# Altium project Votage_Source_v2.PrjPcb
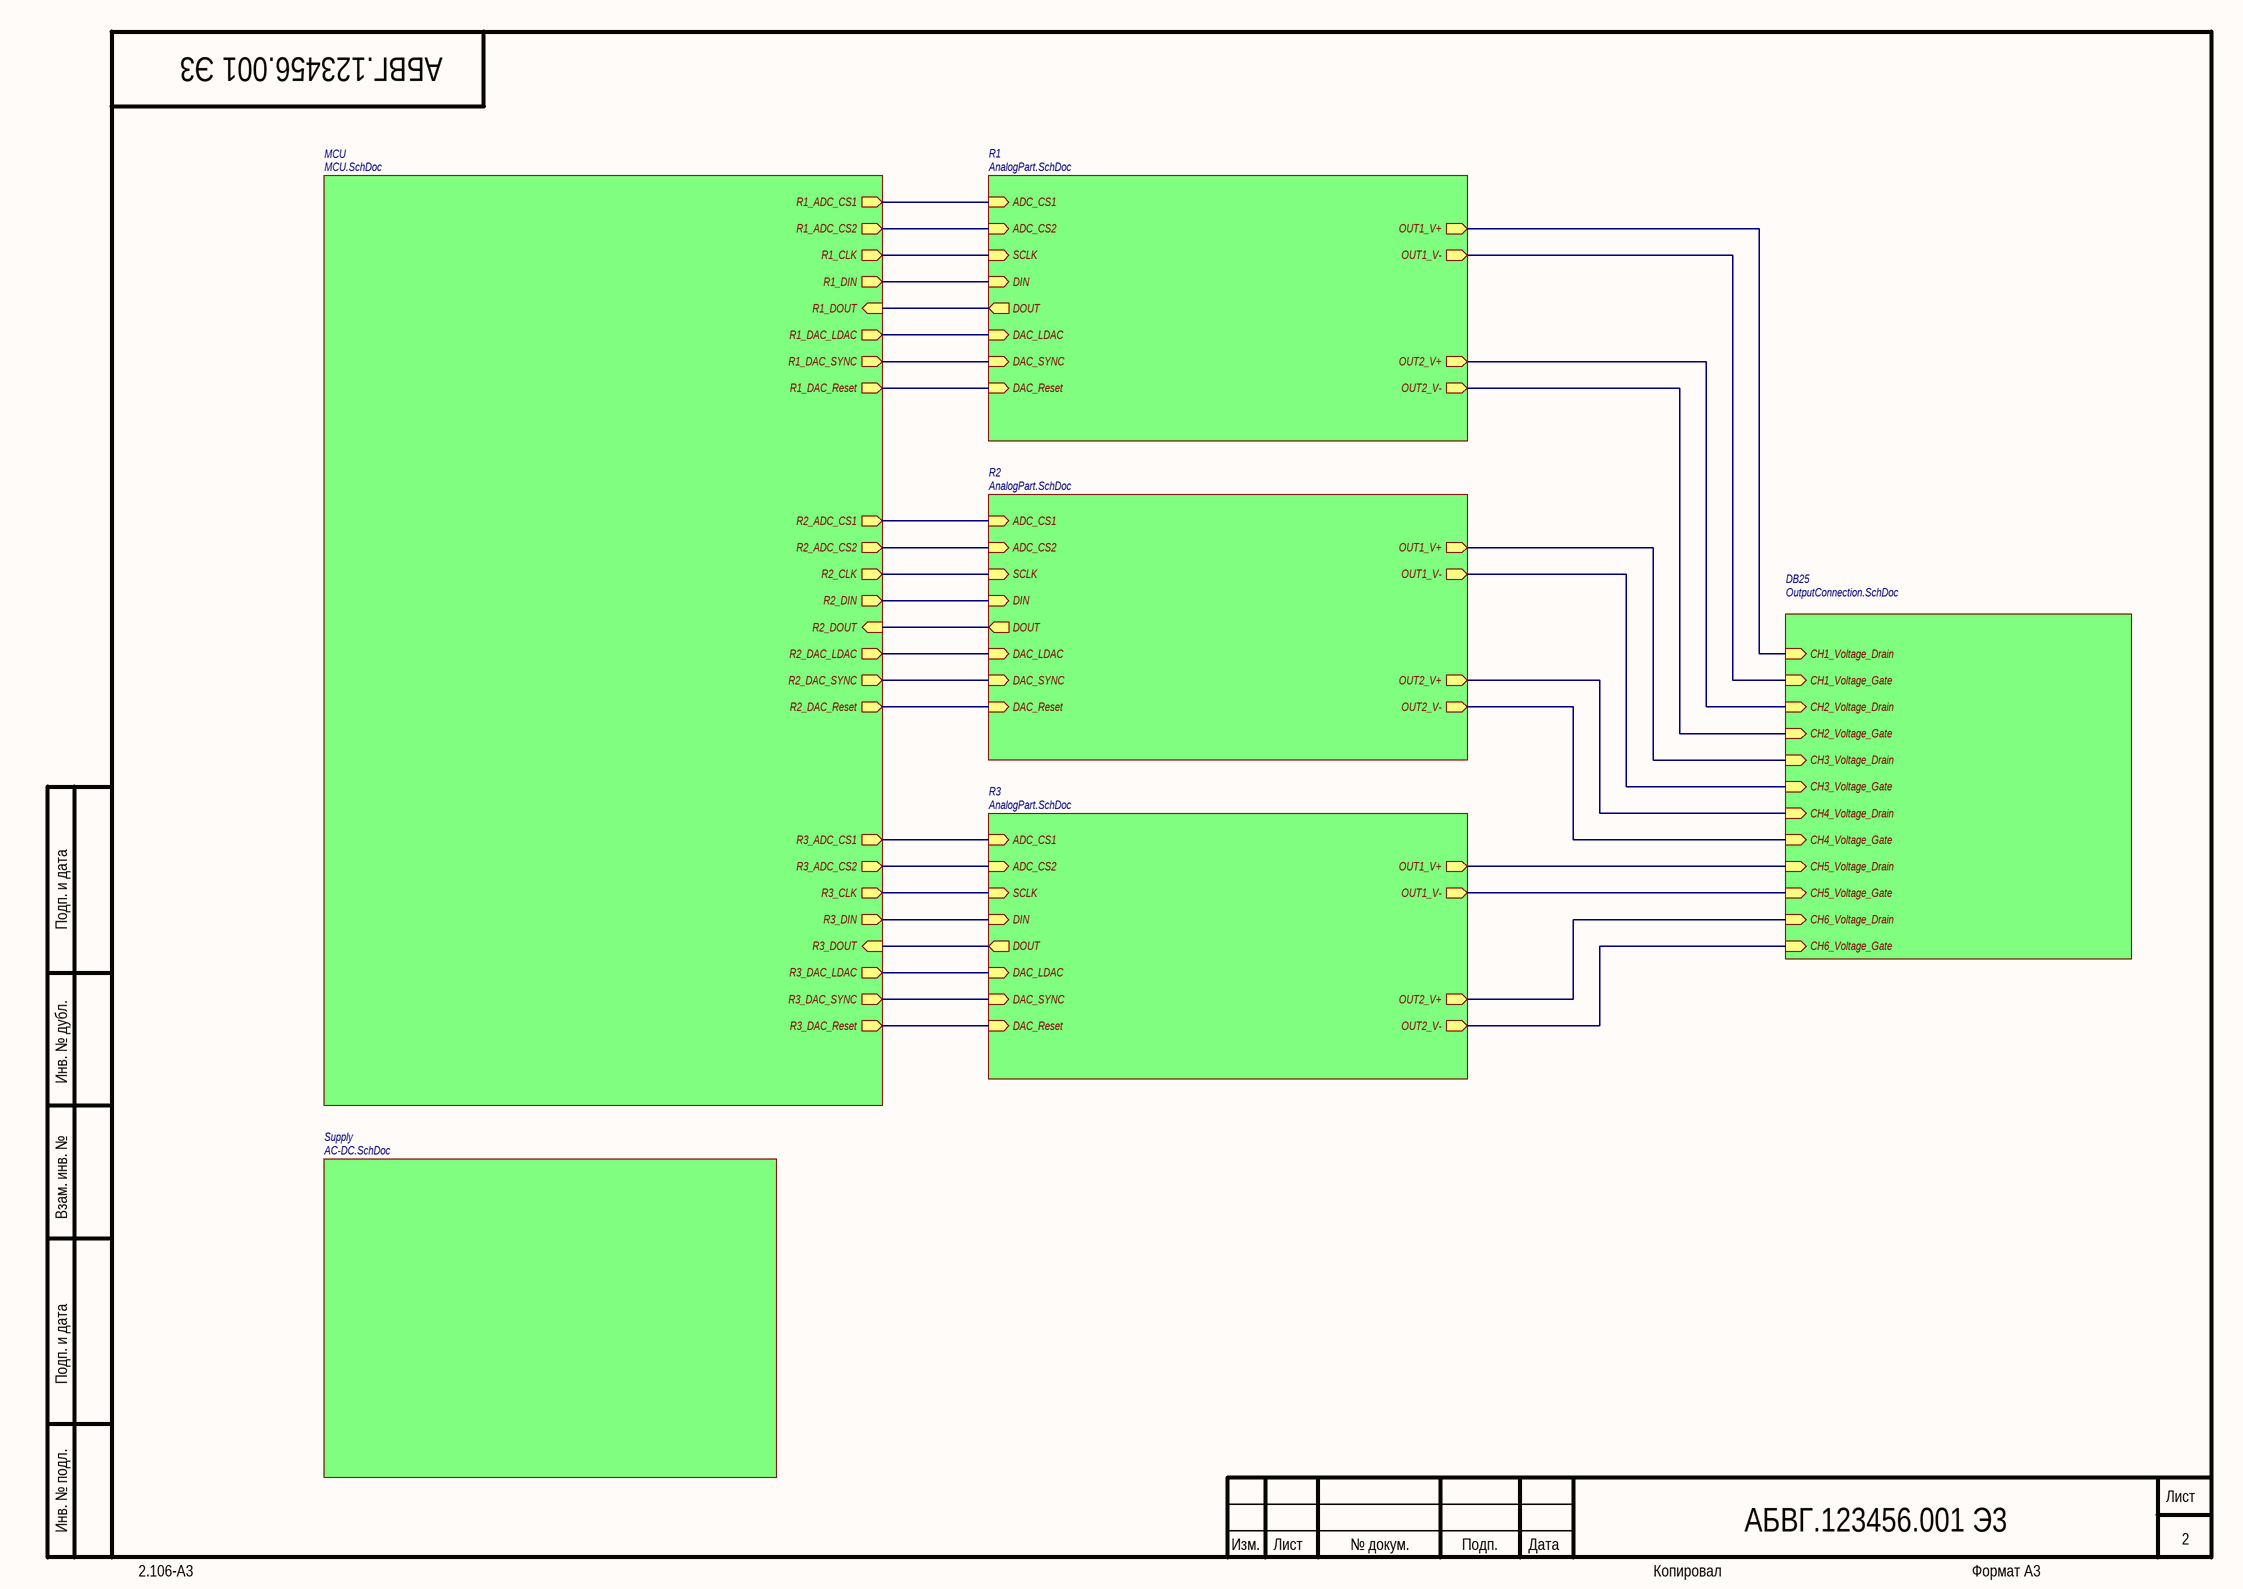
[diagram p0: VS_cs.SchDoc]
5 sheets, 628 parts. Net scope: hierarchical (ports join the sheet entries above them; power ports are global).
Board file: AVS_ver2.PcbDoc
Sheets:
  VS_cs.SchDoc
    DB25 = OutputConnection.SchDoc
    MCU = MCU.SchDoc
    R1 = AnalogPart.SchDoc
    R2 = AnalogPart.SchDoc
    R3 = AnalogPart.SchDoc
    Supply = AC-DC.SchDoc

## Sheet VS_cs.SchDoc
size 420 x 297 mm; Address1: Address1; Address2: Address2; Address3: Address3; Address4: Address4; DocumentNumber: АБВГ.123456.001 Э3; SheetNumber: 2; Scale: 1:1; DocumentType: Схема электрическая принципиальная; FirstReferrence: АБВГ.123456.001

### Sub-sheets
DB25 = OutputConnection.SchDoc: CH1_Voltage_Drain (in), CH2_Voltage_Drain (in), CH3_Voltage_Drain (in), CH4_Voltage_Drain (in), CH5_Voltage_Drain (in), CH1_Voltage_Gate (in), CH2_Voltage_Gate (in), CH3_Voltage_Gate (in), CH4_Voltage_Gate (in), CH5_Voltage_Gate (in), CH6_Voltage_Drain (in), CH6_Voltage_Gate (in)
MCU = MCU.SchDoc: R1_ADC_CS1 (out), R1_CLK (out), R1_DIN (out), R1_DOUT (in), R1_DAC_LDAC (out), R1_DAC_SYNC (out), R1_DAC_Reset (out), R1_ADC_CS2 (out), R2_ADC_CS1 (out), R2_CLK (out), R2_DIN (out), R2_DOUT (in), R2_DAC_LDAC (out), R2_DAC_SYNC (out), R2_DAC_Reset (out), R2_ADC_CS2 (out), R3_ADC_CS1 (out), R3_CLK (out), R3_DIN (out), R3_DOUT (in), R3_DAC_LDAC (out), R3_DAC_SYNC (out), R3_DAC_Reset (out), R3_ADC_CS2 (out)
R1 = AnalogPart.SchDoc: ADC_CS1 (in), SCLK (in), DIN (in), DOUT (out), DAC_LDAC (in), DAC_SYNC (in), DAC_Reset (in), ADC_CS2 (in), OUT1_V+ (out), OUT1_V- (out), OUT2_V+ (out), OUT2_V- (out)
R2 = AnalogPart.SchDoc: ADC_CS1 (in), SCLK (in), DIN (in), DOUT (out), DAC_LDAC (in), DAC_SYNC (in), DAC_Reset (in), ADC_CS2 (in), OUT1_V+ (out), OUT1_V- (out), OUT2_V+ (out), OUT2_V- (out)
R3 = AnalogPart.SchDoc: ADC_CS1 (in), SCLK (in), DIN (in), DOUT (out), DAC_LDAC (in), DAC_SYNC (in), DAC_Reset (in), ADC_CS2 (in), OUT1_V+ (out), OUT1_V- (out), OUT2_V+ (out), OUT2_V- (out)
Supply = AC-DC.SchDoc: no entries

### Nets
E1: sheet MCU/R1_DAC_Reset, sheet R1/DAC_Reset
E2: sheet MCU/R2_DAC_Reset, sheet R2/DAC_Reset
E3: sheet MCU/R3_DAC_Reset, sheet R3/DAC_Reset
NetC47_R1_3: sheet DB25/CH1_Voltage_Drain, sheet R1/OUT1_V+
NetC47_R2_3: sheet DB25/CH3_Voltage_Drain, sheet R2/OUT1_V+
NetC47_R3_3: sheet DB25/CH5_Voltage_Drain, sheet R3/OUT1_V+
NetC50_R1_3: sheet DB25/CH2_Voltage_Drain, sheet R1/OUT2_V+
NetC50_R2_3: sheet DB25/CH4_Voltage_Drain, sheet R2/OUT2_V+
NetC50_R3_3: sheet DB25/CH6_Voltage_Drain, sheet R3/OUT2_V+
NetC53_R1_3: sheet DB25/CH1_Voltage_Gate, sheet R1/OUT1_V-
NetC53_R2_3: sheet DB25/CH3_Voltage_Gate, sheet R2/OUT1_V-
NetC53_R3_3: sheet DB25/CH5_Voltage_Gate, sheet R3/OUT1_V-
NetC54_R1_3: sheet DB25/CH2_Voltage_Gate, sheet R1/OUT2_V-
NetC54_R2_3: sheet DB25/CH4_Voltage_Gate, sheet R2/OUT2_V-
NetC54_R3_3: sheet DB25/CH6_Voltage_Gate, sheet R3/OUT2_V-
NetDD4_41: sheet MCU/R1_ADC_CS1, sheet R1/ADC_CS1
NetDD4_42: sheet MCU/R1_CLK, sheet R1/SCLK
NetDD4_43: sheet MCU/R1_DIN, sheet R1/DIN
NetDD4_44: sheet MCU/R1_DOUT, sheet R1/DOUT
NetDD4_45: sheet MCU/R1_DAC_LDAC, sheet R1/DAC_LDAC
NetDD4_46: sheet MCU/R1_DAC_SYNC, sheet R1/DAC_SYNC
NetDD4_48: sheet MCU/R1_ADC_CS2, sheet R1/ADC_CS2
NetDD4_51: sheet MCU/R2_ADC_CS1, sheet R2/ADC_CS1
NetDD4_52: sheet MCU/R2_CLK, sheet R2/SCLK
NetDD4_53: sheet MCU/R2_DIN, sheet R2/DIN
NetDD4_54: sheet MCU/R2_DOUT, sheet R2/DOUT
NetDD4_55: sheet MCU/R2_DAC_LDAC, sheet R2/DAC_LDAC
NetDD4_56: sheet MCU/R2_DAC_SYNC, sheet R2/DAC_SYNC
NetDD4_58: sheet MCU/R2_ADC_CS2, sheet R2/ADC_CS2
NetDD4_59: sheet MCU/R3_ADC_CS1, sheet R3/ADC_CS1
NetDD4_60: sheet MCU/R3_CLK, sheet R3/SCLK
NetDD4_61: sheet MCU/R3_DIN, sheet R3/DIN
NetDD4_62: sheet MCU/R3_DOUT, sheet R3/DOUT
NetDD4_63: sheet MCU/R3_DAC_LDAC, sheet R3/DAC_LDAC
NetDD4_64: sheet MCU/R3_DAC_SYNC, sheet R3/DAC_SYNC
NetDD4_66: sheet MCU/R3_ADC_CS2, sheet R3/ADC_CS2

### Notes on the sheet
- Подп. и дата
- Инв. № дубл.
- Взам. инв. №
- Инв. № подл.
- Изм.
- Лист
- № докум.
- Подп.
- Дата
- 2.106-A3
- Копировал
- Формат А3

## Sheet OutputConnection.SchDoc
size 420 x 297 mm; Address1: Address1; Address2: Address2; Address3: Address3; Address4: Address4; DocumentNumber: АБВГ.123456.001 Э3; SheetNumber: 2; Scale: 1:1; DocumentType: Схема электрическая принципиальная; FirstReferrence: АБВГ.123456.001
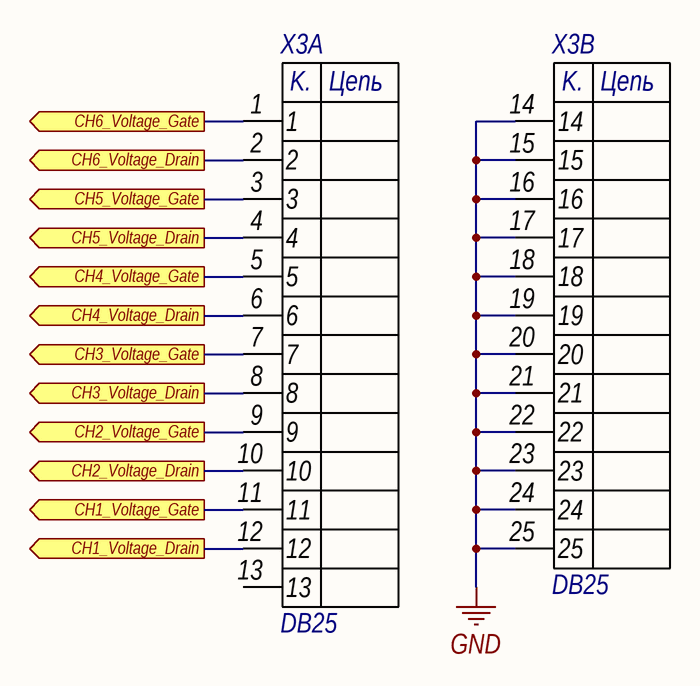
[diagram p1: OutputConnection.SchDoc]

### Parts
X3  DB25  [DB25F]  (parts A,B of 2)

### Ports
CH1_Voltage_Drain (out), CH1_Voltage_Gate (out), CH2_Voltage_Drain (out), CH2_Voltage_Gate (out), CH3_Voltage_Drain (out), CH3_Voltage_Gate (out), CH4_Voltage_Drain (out), CH4_Voltage_Gate (out), CH5_Voltage_Drain (out), CH5_Voltage_Gate (out), CH6_Voltage_Drain (out), CH6_Voltage_Gate (out)

### Nets
GND: X3.14 X3.15 X3.16 X3.17 X3.18 X3.19 X3.20 X3.21 X3.22 X3.23 X3.24 X3.25
NetC47_R1_3: X3.12 ; port CH1_Voltage_Drain
NetC47_R2_3: X3.8 ; port CH3_Voltage_Drain
NetC47_R3_3: X3.4 ; port CH5_Voltage_Drain
NetC50_R1_3: X3.10 ; port CH2_Voltage_Drain
NetC50_R2_3: X3.6 ; port CH4_Voltage_Drain
NetC50_R3_3: X3.2 ; port CH6_Voltage_Drain
NetC53_R1_3: X3.11 ; port CH1_Voltage_Gate
NetC53_R2_3: X3.7 ; port CH3_Voltage_Gate
NetC53_R3_3: X3.3 ; port CH5_Voltage_Gate
NetC54_R1_3: X3.9 ; port CH2_Voltage_Gate
NetC54_R2_3: X3.5 ; port CH4_Voltage_Gate
NetC54_R3_3: X3.1 ; port CH6_Voltage_Gate

Not connected (* = marked no-connect by the designer): X3 13

### Notes on the sheet
- Подп. и дата
- Инв. № дубл.
- Взам. инв. №
- Инв. № подл.
- Изм.
- Лист
- № докум.
- Подп.
- Дата
- 2.106-A3
- Копировал
- Формат А3
- (in symbol DB25, part A) K.; Цепь
- (in symbol DB25, part B) K.; Цепь

## Sheet MCU.SchDoc
size 594 x 420 mm; Address1: Address1; Address2: Address2; Address3: Address3; Address4: Address4; DocumentNumber: АБВГ.123456.001 Э3; SheetNumber: 2; Scale: 1:1; DocumentType: Схема электрическая принципиальная; FirstReferrence: АБВГ.123456.001; PageSetup: Record=PageOptions|CenterHorizontal=False|CenterVertical=False|PrintScale=0.95|XCorrection=0.00|YCorrection=0.00|PrintKind=1|BorderSize=5000000|LeftOffset=0|BottomOffset=0|Orientation=1|PaperLength=1000|PaperWidth=1000|Scale=100|PaperSource=15|PrintQuality=600|MediaType=1|DitherType=10|PaperKind=A4|PrintScaleMode=1
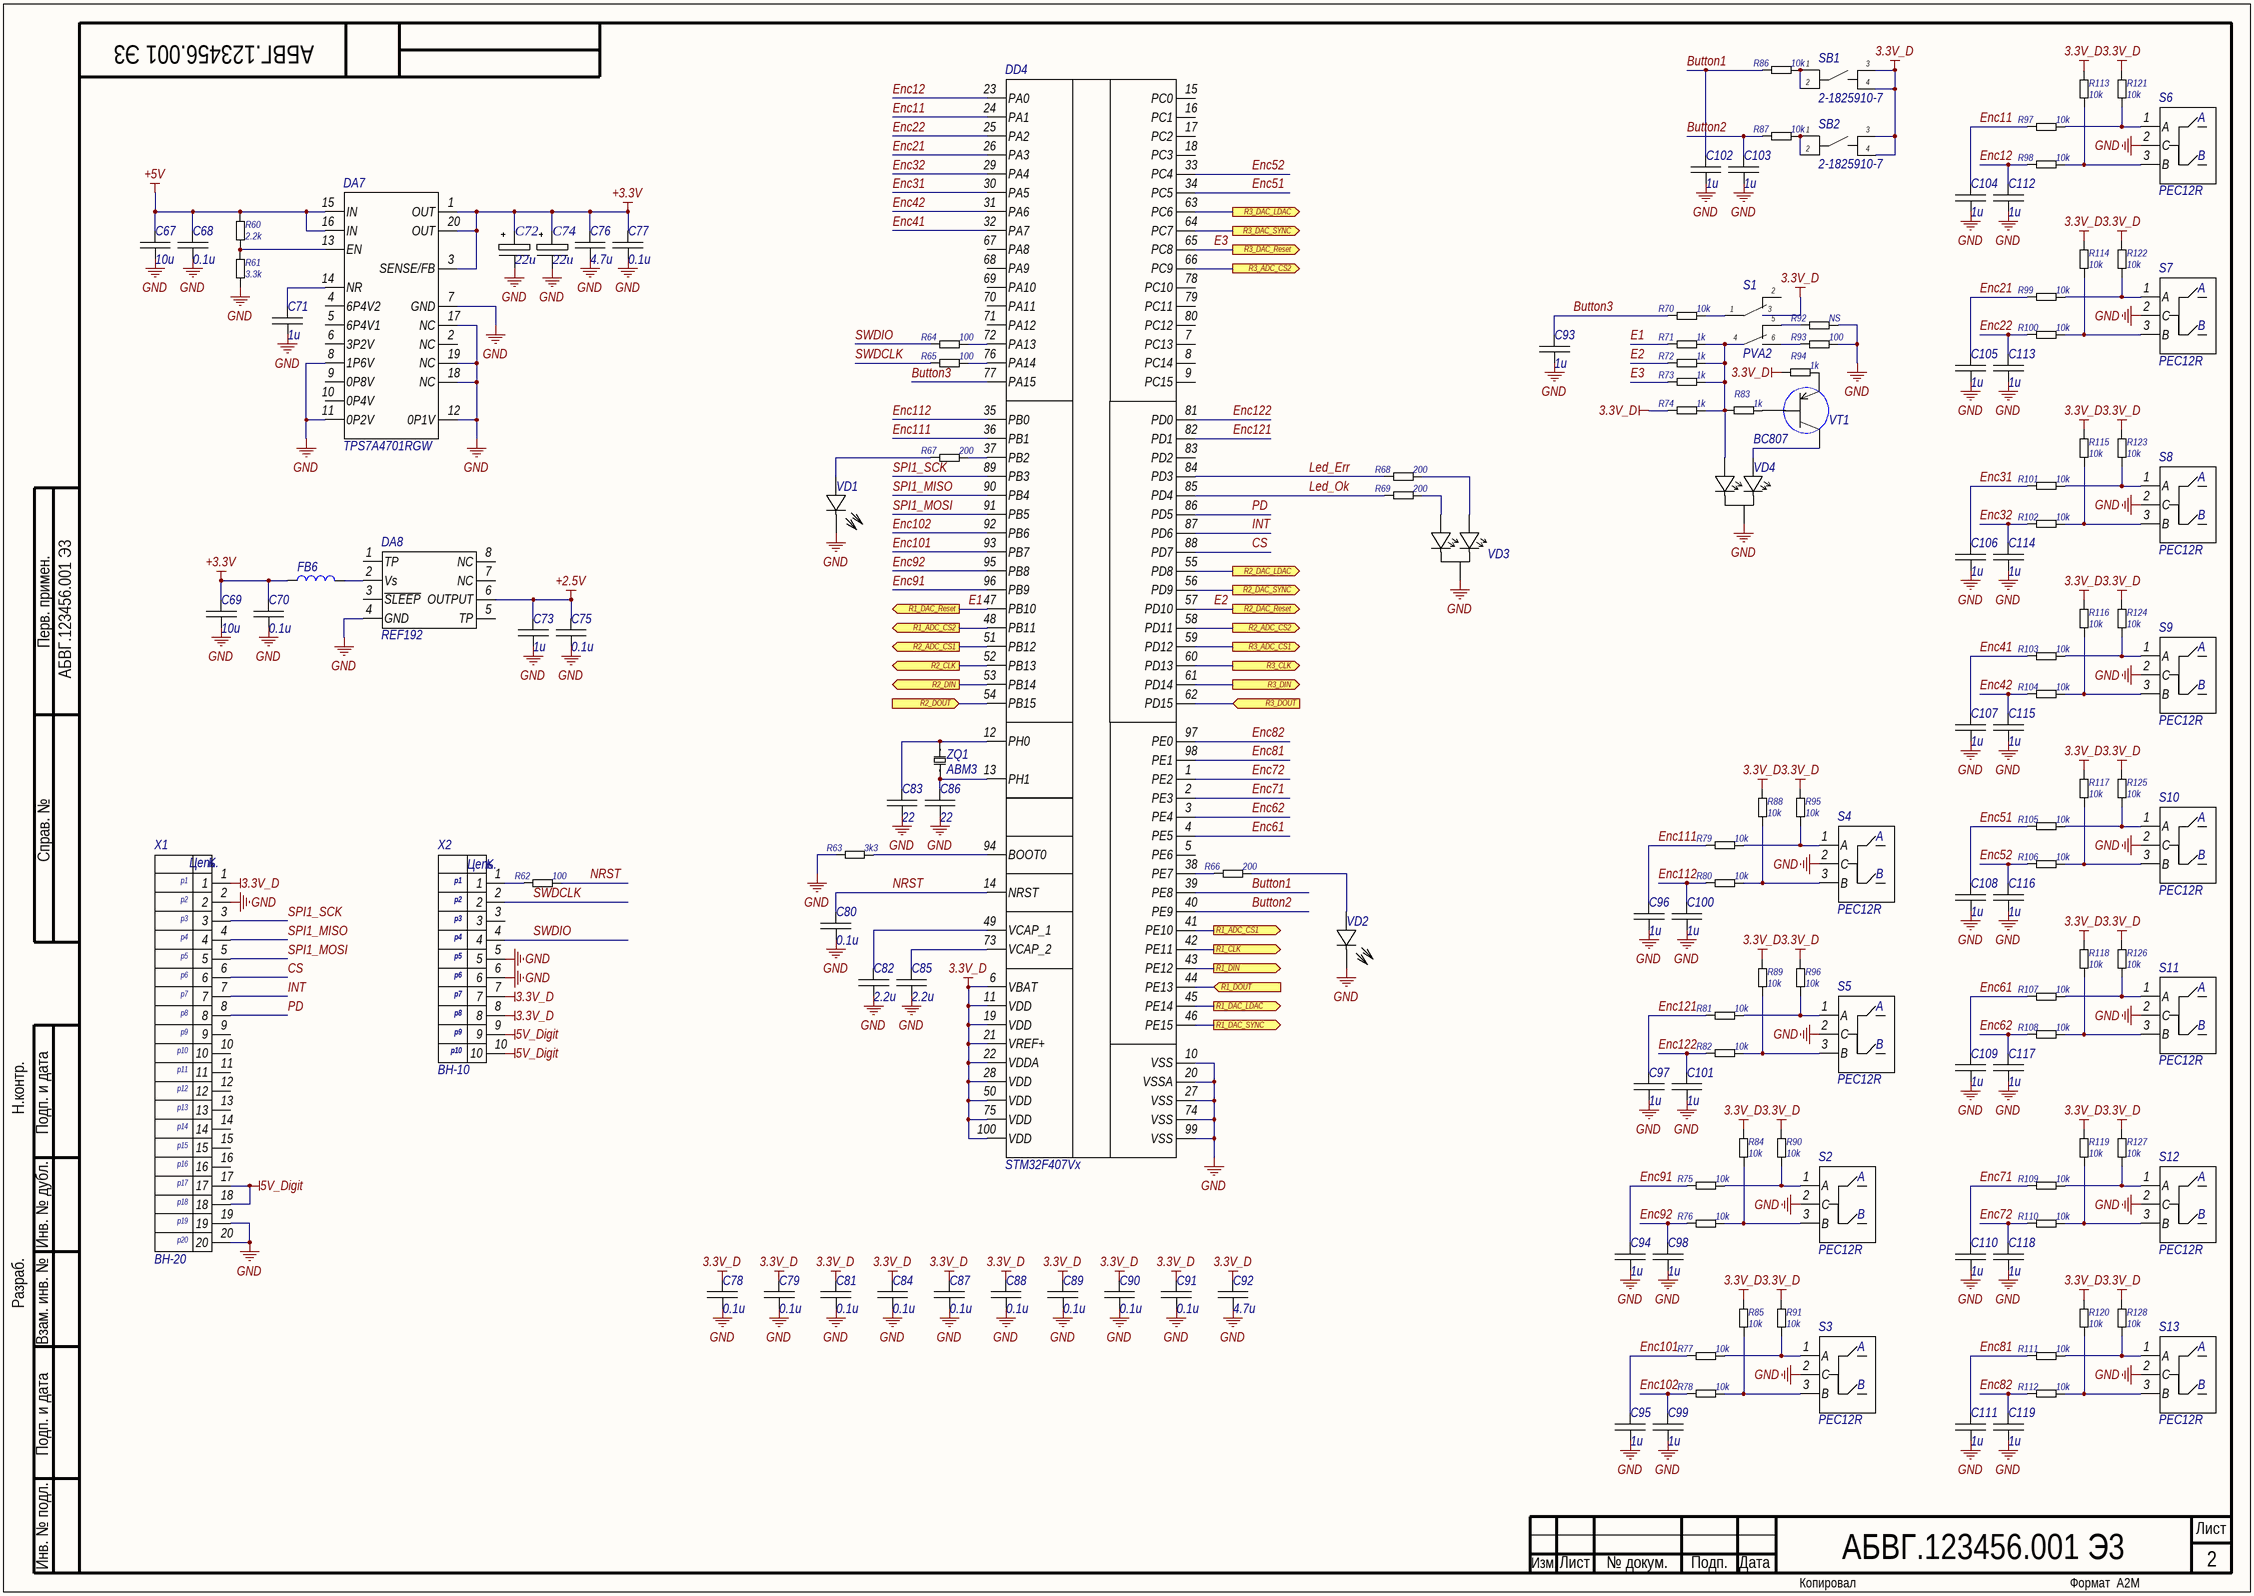
[diagram p2: MCU.SchDoc]

### Parts
C67  10u  [C1206]
C68  0.1u  [C0805]
C69  10u  [C1206]
C70  0.1u  [C0805]
C71  1u  [C0805]
C72  22u  [C0605]
C73  1u  [C0805]
C74  22u  [C0605]
C75  0.1u  [C0805]
C76  4.7u  [C0805]
C77  0.1u  [C0805]
C78  0.1u  [C0603]
C79  0.1u  [C0603]
C80  0.1u  [C0603]
C81  0.1u  [C0603]
C82  2.2u  [C0805]
C83  22  [C0603]
C84  0.1u  [C0603]
C85  2.2u  [C0805]
C86  22  [C0603]
C87  0.1u  [C0603]
C88  0.1u  [C0603]
C89  0.1u  [C0603]
C90  0.1u  [C0603]
C91  0.1u  [C0603]
C92  4.7u  [C0805]
C93  1u  [C0805]
C94  1u  [C0805]
C95  1u  [C0805]
C96  1u  [C0805]
C97  1u  [C0805]
C98  1u  [C0805]
C99  1u  [C0805]
C100  1u  [C0805]
C101  1u  [C0805]
C102  1u  [C0805]
C103  1u  [C0805]
C104  1u  [C0805]
C105  1u  [C0805]
C106  1u  [C0805]
C107  1u  [C0805]
C108  1u  [C0805]
C109  1u  [C0805]
C110  1u  [C0805]
C111  1u  [C0805]
C112  1u  [C0805]
C113  1u  [C0805]
C114  1u  [C0805]
C115  1u  [C0805]
C116  1u  [C0805]
C117  1u  [C0805]
C118  1u  [C0805]
C119  1u  [C0805]
DA7  TPS7A4701RGW  [QFN20 5x5]
DA8  REF192  [TSSOP-8_4mm]
DD4  STM32F407Vx  [LQFP100]
FB6  MH1608-601Y  [L0603]  (value not drawn)
R60  2.2k  [CR0805]
R61  3.3k  [CR0805]
R62  100  [CR0603]
R63  3k3  [CR0603]
R64  100  [CR0603]
R65  100  [CR0603]
R66  200  [CR0805]
R67  200  [CR0805]
R68  200  [CR0805]
R69  200  [CR0805]
R70  10k  [CR0805]
R71  1k  [CR0805]
R72  1k  [CR0805]
R73  1k  [CR0805]
R74  1k  [CR0805]
R75  10k  [CR0805]
R76  10k  [CR0805]
R77  10k  [CR0805]
R78  10k  [CR0805]
R79  10k  [CR0805]
R80  10k  [CR0805]
R81  10k  [CR0805]
R82  10k  [CR0805]
R83  1k  [CR0805]
R84  10k  [CR0805]
R85  10k  [CR0805]
R86  10k  [CR0805]
R87  10k  [CR0805]
R88  10k  [CR0805]
R89  10k  [CR0805]
R90  10k  [CR0805]
R91  10k  [CR0805]
R92  NS  [CR0805]
R93  100  [CR0805]
R94  1k  [CR0805]
R95  10k  [CR0805]
R96  10k  [CR0805]
R97  10k  [CR0805]
R98  10k  [CR0805]
R99  10k  [CR0805]
R100  10k  [CR0805]
R101  10k  [CR0805]
R102  10k  [CR0805]
R103  10k  [CR0805]
R104  10k  [CR0805]
R105  10k  [CR0805]
R106  10k  [CR0805]
R107  10k  [CR0805]
R108  10k  [CR0805]
R109  10k  [CR0805]
R110  10k  [CR0805]
R111  10k  [CR0805]
R112  10k  [CR0805]
R113  10k  [CR0805]
R114  10k  [CR0805]
R115  10k  [CR0805]
R116  10k  [CR0805]
R117  10k  [CR0805]
R118  10k  [CR0805]
R119  10k  [CR0805]
R120  10k  [CR0805]
R121  10k  [CR0805]
R122  10k  [CR0805]
R123  10k  [CR0805]
R124  10k  [CR0805]
R125  10k  [CR0805]
R126  10k  [CR0805]
R127  10k  [CR0805]
R128  10k  [CR0805]
S1  PVA2  [PVA2]
S2  PEC12R  [PEC12R]
S3  PEC12R  [PEC12R]
S4  PEC12R  [PEC12R]
S5  PEC12R  [PEC12R]
S6  PEC12R  [PEC12R]
S7  PEC12R  [PEC12R]
S8  PEC12R  [PEC12R]
S9  PEC12R  [PEC12R]
S10  PEC12R  [PEC12R]
S11  PEC12R  [PEC12R]
S12  PEC12R  [PEC12R]
S13  PEC12R  [PEC12R]
SB1  2-1825910-7  [Tactile_Button]
SB2  2-1825910-7  [Tactile_Button]
VD1  0805  [led 0805]  (value not drawn)
VD2  0805  [led 0805]  (value not drawn)
VD3  LED_BI  [LED_BI_5mm]  (value not drawn)
VD4  LED_BI  [LED_BI_5mm]  (value not drawn)
VT1  BC807  [SOT23]
X1  BH-20  [BH-20]
X2  BH-10  [BH-10]
ZQ1  ABM3  [ABM3]

### Ports
R1_ADC_CS1 (out), R1_ADC_CS2 (out), R1_CLK (out), R1_DAC_LDAC (out), R1_DAC_Reset (out), R1_DAC_SYNC (out), R1_DIN (out), R1_DOUT (in), R2_ADC_CS1 (out), R2_ADC_CS2 (out), R2_CLK (out), R2_DAC_LDAC (out), R2_DAC_Reset (out), R2_DAC_SYNC (out), R2_DIN (out), R2_DOUT (in), R3_ADC_CS1 (out), R3_ADC_CS2 (out), R3_CLK (out), R3_DAC_LDAC (out), R3_DAC_Reset (out), R3_DAC_SYNC (out), R3_DIN (out), R3_DOUT (in)

### Nets
3.3V_D: C78.1 C79.1 C81.1 C84.1 C87.1 C88.1 C89.1 C90.1 C91.1 C92.1 DD4.6(VBAT) DD4.11(VDD) DD4.19(VDD) DD4.21(VREF+) DD4.22(VDDA) DD4.28(VDD) DD4.50(VDD) DD4.75(VDD) DD4.100(VDD) R74.1 R84.2 R85.2 R88.2 R89.2 R90.2 R91.2 R94.1 R95.2 R96.2 R113.2 R114.2 R115.2 R116.2 R117.2 R118.2 R119.2 R120.2 R121.2 R122.2 R123.2 R124.2 R125.2 R126.2 R127.2 R128.2 S1.3 SB1.3 SB1.4 SB2.3 SB2.4 X1.1 X2.7 X2.8
5V_Digit: X1.17 X1.18 X2.9 X2.10
+2.5V: C73.1 C75.1 DA8.6(OUTPUT)
+3.3V: C69.1 C70.1 C72.1 C74.1 C76.1 C77.1 DA7.1(OUT) DA7.3(SENSE/FB) DA7.20(OUT) FB6.1
+5V: C67.1 C68.1 DA7.15(IN) DA7.16(IN) R60.2
GND: C67.2 C68.2 C69.2 C70.2 C71.2 C72.2 C73.2 C74.2 C75.2 C76.2 C77.2 C78.2 C79.2 C80.2 C81.2 C82.2 C83.2 C84.2 C85.2 C86.2 C87.2 C88.2 C89.2 C90.2 C91.2 C92.2 C93.2 C94.2 C95.2 C96.2 C97.2 C98.2 C99.2 C100.2 C101.2 C102.2 C103.2 C104.2 C105.2 C106.2 C107.2 C108.2 C109.2 C110.2 C111.2 C112.2 C113.2 C114.2 C115.2 C116.2 C117.2 C118.2 C119.2 DA7.7(GND) DA7.8(1P6V) DA7.11(0P2V) DA7.12(0P1V) DA7.17(NC) DA7.18(NC) DA7.19(NC) DA8.4(GND) DD4.10(VSS) DD4.20(VSSA) DD4.27(VSS) DD4.74(VSS) DD4.99(VSS) R61.1 R63.1 R92.2 R93.2 S2.2(C) S3.2(C) S4.2(C) S5.2(C) S6.2(C) S7.2(C) S8.2(C) S9.2(C) S10.2(C) S11.2(C) S12.2(C) S13.2(C) VD1.2 VD2.2 VD3.2 VD4.2 X1.2 X1.19 X1.20 X2.5 X2.6
Button1: C102.1 DD4.39(PE8) R86.1
Button2: C103.1 DD4.40(PE9) R87.1
Button3: C93.1 DD4.77(PA15) R70.1
CS: DD4.88(PD7) X1.6
E1: DD4.47(PB10) R71.1 ; port R1_DAC_Reset
E2: DD4.57(PD10) R72.1 ; port R2_DAC_Reset
E3: DD4.65(PC8) R73.1 ; port R3_DAC_Reset
Enc11: C104.1 DD4.24(PA1) R97.1
Enc12: C112.1 DD4.23(PA0) R98.1
Enc21: C105.1 DD4.26(PA3) R99.1
Enc22: C113.1 DD4.25(PA2) R100.1
Enc31: C106.1 DD4.30(PA5) R101.1
Enc32: C114.1 DD4.29(PA4) R102.1
Enc41: C107.1 DD4.32(PA7) R103.1
Enc42: C115.1 DD4.31(PA6) R104.1
Enc51: C108.1 DD4.34(PC5) R105.1
Enc52: C116.1 DD4.33(PC4) R106.1
Enc61: C109.1 DD4.4(PE5) R107.1
Enc62: C117.1 DD4.3(PE4) R108.1
Enc71: C110.1 DD4.2(PE3) R109.1
Enc72: C118.1 DD4.1(PE2) R110.1
Enc81: C111.1 DD4.98(PE1) R111.1
Enc82: C119.1 DD4.97(PE0) R112.1
Enc91: C94.1 DD4.96(PB9) R75.1
Enc92: C98.1 DD4.95(PB8) R76.1
Enc101: C95.1 DD4.93(PB7) R77.1
Enc102: C99.1 DD4.92(PB6) R78.1
Enc111: C96.1 DD4.36(PB1) R79.1
Enc112: C100.1 DD4.35(PB0) R80.1
Enc121: C97.1 DD4.82(PD1) R81.1
Enc122: C101.1 DD4.81(PD0) R82.1
INT: DD4.87(PD6) X1.7
Led_Err: DD4.84(PD3) R68.1
Led_Ok: DD4.85(PD4) R69.1
NRST: C80.1 DD4.14(NRST) R62.2
PD: DD4.86(PD5) X1.8
SPI1_MISO: DD4.90(PB4) X1.4
SPI1_MOSI: DD4.91(PB5) X1.5
SPI1_SCK: DD4.89(PB3) X1.3
SWDCLK: R65.1 X2.2
SWDIO: R64.1 X2.4
NetC71_1: C71.1 DA7.14(NR)
NetC82_1: C82.1 DD4.49(VCAP_1)
NetC83_1: C83.1 DD4.12(PH0) ZQ1.2
NetC85_1: C85.1 DD4.73(VCAP_2)
NetC86_1: C86.1 DD4.13(PH1) ZQ1.1
NetDA7_13: DA7.13(EN) R60.1 R61.2
NetDA8_2: DA8.2(Vs) FB6.2
NetDD4_37: DD4.37(PB2) R67.1
NetDD4_38: DD4.38(PE7) R66.2
NetDD4_41: DD4.41(PE10) ; port R1_ADC_CS1
NetDD4_42: DD4.42(PE11) ; port R1_CLK
NetDD4_43: DD4.43(PE12) ; port R1_DIN
NetDD4_44: DD4.44(PE13) ; port R1_DOUT
NetDD4_45: DD4.45(PE14) ; port R1_DAC_LDAC
NetDD4_46: DD4.46(PE15) ; port R1_DAC_SYNC
NetDD4_48: DD4.48(PB11) ; port R1_ADC_CS2
NetDD4_51: DD4.51(PB12) ; port R2_ADC_CS1
NetDD4_52: DD4.52(PB13) ; port R2_CLK
NetDD4_53: DD4.53(PB14) ; port R2_DIN
NetDD4_54: DD4.54(PB15) ; port R2_DOUT
NetDD4_55: DD4.55(PD8) ; port R2_DAC_LDAC
NetDD4_56: DD4.56(PD9) ; port R2_DAC_SYNC
NetDD4_58: DD4.58(PD11) ; port R2_ADC_CS2
NetDD4_59: DD4.59(PD12) ; port R3_ADC_CS1
NetDD4_60: DD4.60(PD13) ; port R3_CLK
NetDD4_61: DD4.61(PD14) ; port R3_DIN
NetDD4_62: DD4.62(PD15) ; port R3_DOUT
NetDD4_63: DD4.63(PC6) ; port R3_DAC_LDAC
NetDD4_64: DD4.64(PC7) ; port R3_DAC_SYNC
NetDD4_66: DD4.66(PC9) ; port R3_ADC_CS2
NetDD4_72: DD4.72(PA13) R64.2
NetDD4_76: DD4.76(PA14) R65.2
NetDD4_94: DD4.94(BOOT0) R63.2
NetR62_1: R62.1 X2.1
NetR66_1: R66.1 VD2.1
NetR67_2: R67.2 VD1.1
NetR68_2: R68.2 VD3.1
NetR69_2: R69.2 VD3.3
NetR70_2: R70.2 S1.1
NetR71_2: R71.2 R72.2 R73.2 R74.2 R83.1 S1.4 VD4.3
NetR75_2: R75.2 R90.1 S2.1(A)
NetR76_2: R76.2 R84.1 S2.3(B)
NetR77_2: R77.2 R91.1 S3.1(A)
NetR78_2: R78.2 R85.1 S3.3(B)
NetR79_2: R79.2 R95.1 S4.1(A)
NetR80_2: R80.2 R88.1 S4.3(B)
NetR81_2: R81.2 R96.1 S5.1(A)
NetR82_2: R82.2 R89.1 S5.3(B)
NetR83_2: R83.2 VT1.1
NetR86_2: R86.2 SB1.1 SB1.2
NetR87_2: R87.2 SB2.1 SB2.2
NetR92_1: R92.1 S1.5
NetR93_1: R93.1 S1.6
NetR94_2: R94.2 VT1.2
NetR97_2: R97.2 R121.1 S6.1(A)
NetR98_2: R98.2 R113.1 S6.3(B)
NetR99_2: R99.2 R122.1 S7.1(A)
NetR100_2: R100.2 R114.1 S7.3(B)
NetR101_2: R101.2 R123.1 S8.1(A)
NetR102_2: R102.2 R115.1 S8.3(B)
NetR103_2: R103.2 R124.1 S9.1(A)
NetR104_2: R104.2 R116.1 S9.3(B)
NetR105_2: R105.2 R125.1 S10.1(A)
NetR106_2: R106.2 R117.1 S10.3(B)
NetR107_2: R107.2 R126.1 S11.1(A)
NetR108_2: R108.2 R118.1 S11.3(B)
NetR109_2: R109.2 R127.1 S12.1(A)
NetR110_2: R110.2 R119.1 S12.3(B)
NetR111_2: R111.2 R128.1 S13.1(A)
NetR112_2: R112.2 R120.1 S13.3(B)
NetVD4_1: VD4.1 VT1.3

Not connected (* = marked no-connect by the designer): DA7 2(NC) 4(6P4V2) 5(6P4V1) 6(3P2V) 9(0P8V) 10(0P4V); DA8 1(TP) 3(~{SLEEP}) 5(TP) 7(NC) 8(NC); DD4 5(PE6) 7(PC13) 8(PC14) 9(PC15) 15(PC0) 16(PC1) 17(PC2) 18(PC3) 67(PA8) 68(PA9) 69(PA10) 70(PA11) 71(PA12) 78(PC10) 79(PC11) 80(PC12) 83(PD2); S1 2; X1 9 10 11 12 13 14 15 16; X2 3

### Notes on the sheet
- Перв. примен.
- Справ. №
- Н.контр.
- Подп. и дата
- Инв. № дубл.
- Разраб.
- Взам. инв. №
- Инв. № подл.
- Лист
- Изм.
- № докум.
- Подп.
- Дата
- Копировал
- Формат  A2М
- (in symbol BH-10) Цепь; K.; p1; p2; p3; p4; p5; p6; p7; p8; p9; p10
- (in symbol BH-20) Цепь; K.; p1; p2; p3; p4; p5; p6; p7; p8; p9; p10; p11; p12; p13; p14; p15; p16; p17; p18; p19; p20

### Library data of the parts
C67-C71 C73 C75-C119 = Capacitor Ceramic SMD
C72 C74 = Capacitor Electrolytic
FB6 = Ferrite Bead
R60-R128 = Resistor SMD
S1 = Switch - Push-Push
S2-S13 = Encoder incremental
SB1 SB2 = Tactile Button
VD1 VD2 = led 0805
ZQ1 = Quartz ABM3

## Sheet AnalogPart.SchDoc
size 594 x 420 mm; Scale: 1:1; DocumentType: Схема электрическая принципиальная; FirstReferrence: АБВГ.123456.001
Used 3 times, as channels R1, R2, R3. Parts and nets are listed once, with the designators drawn on the sheet.
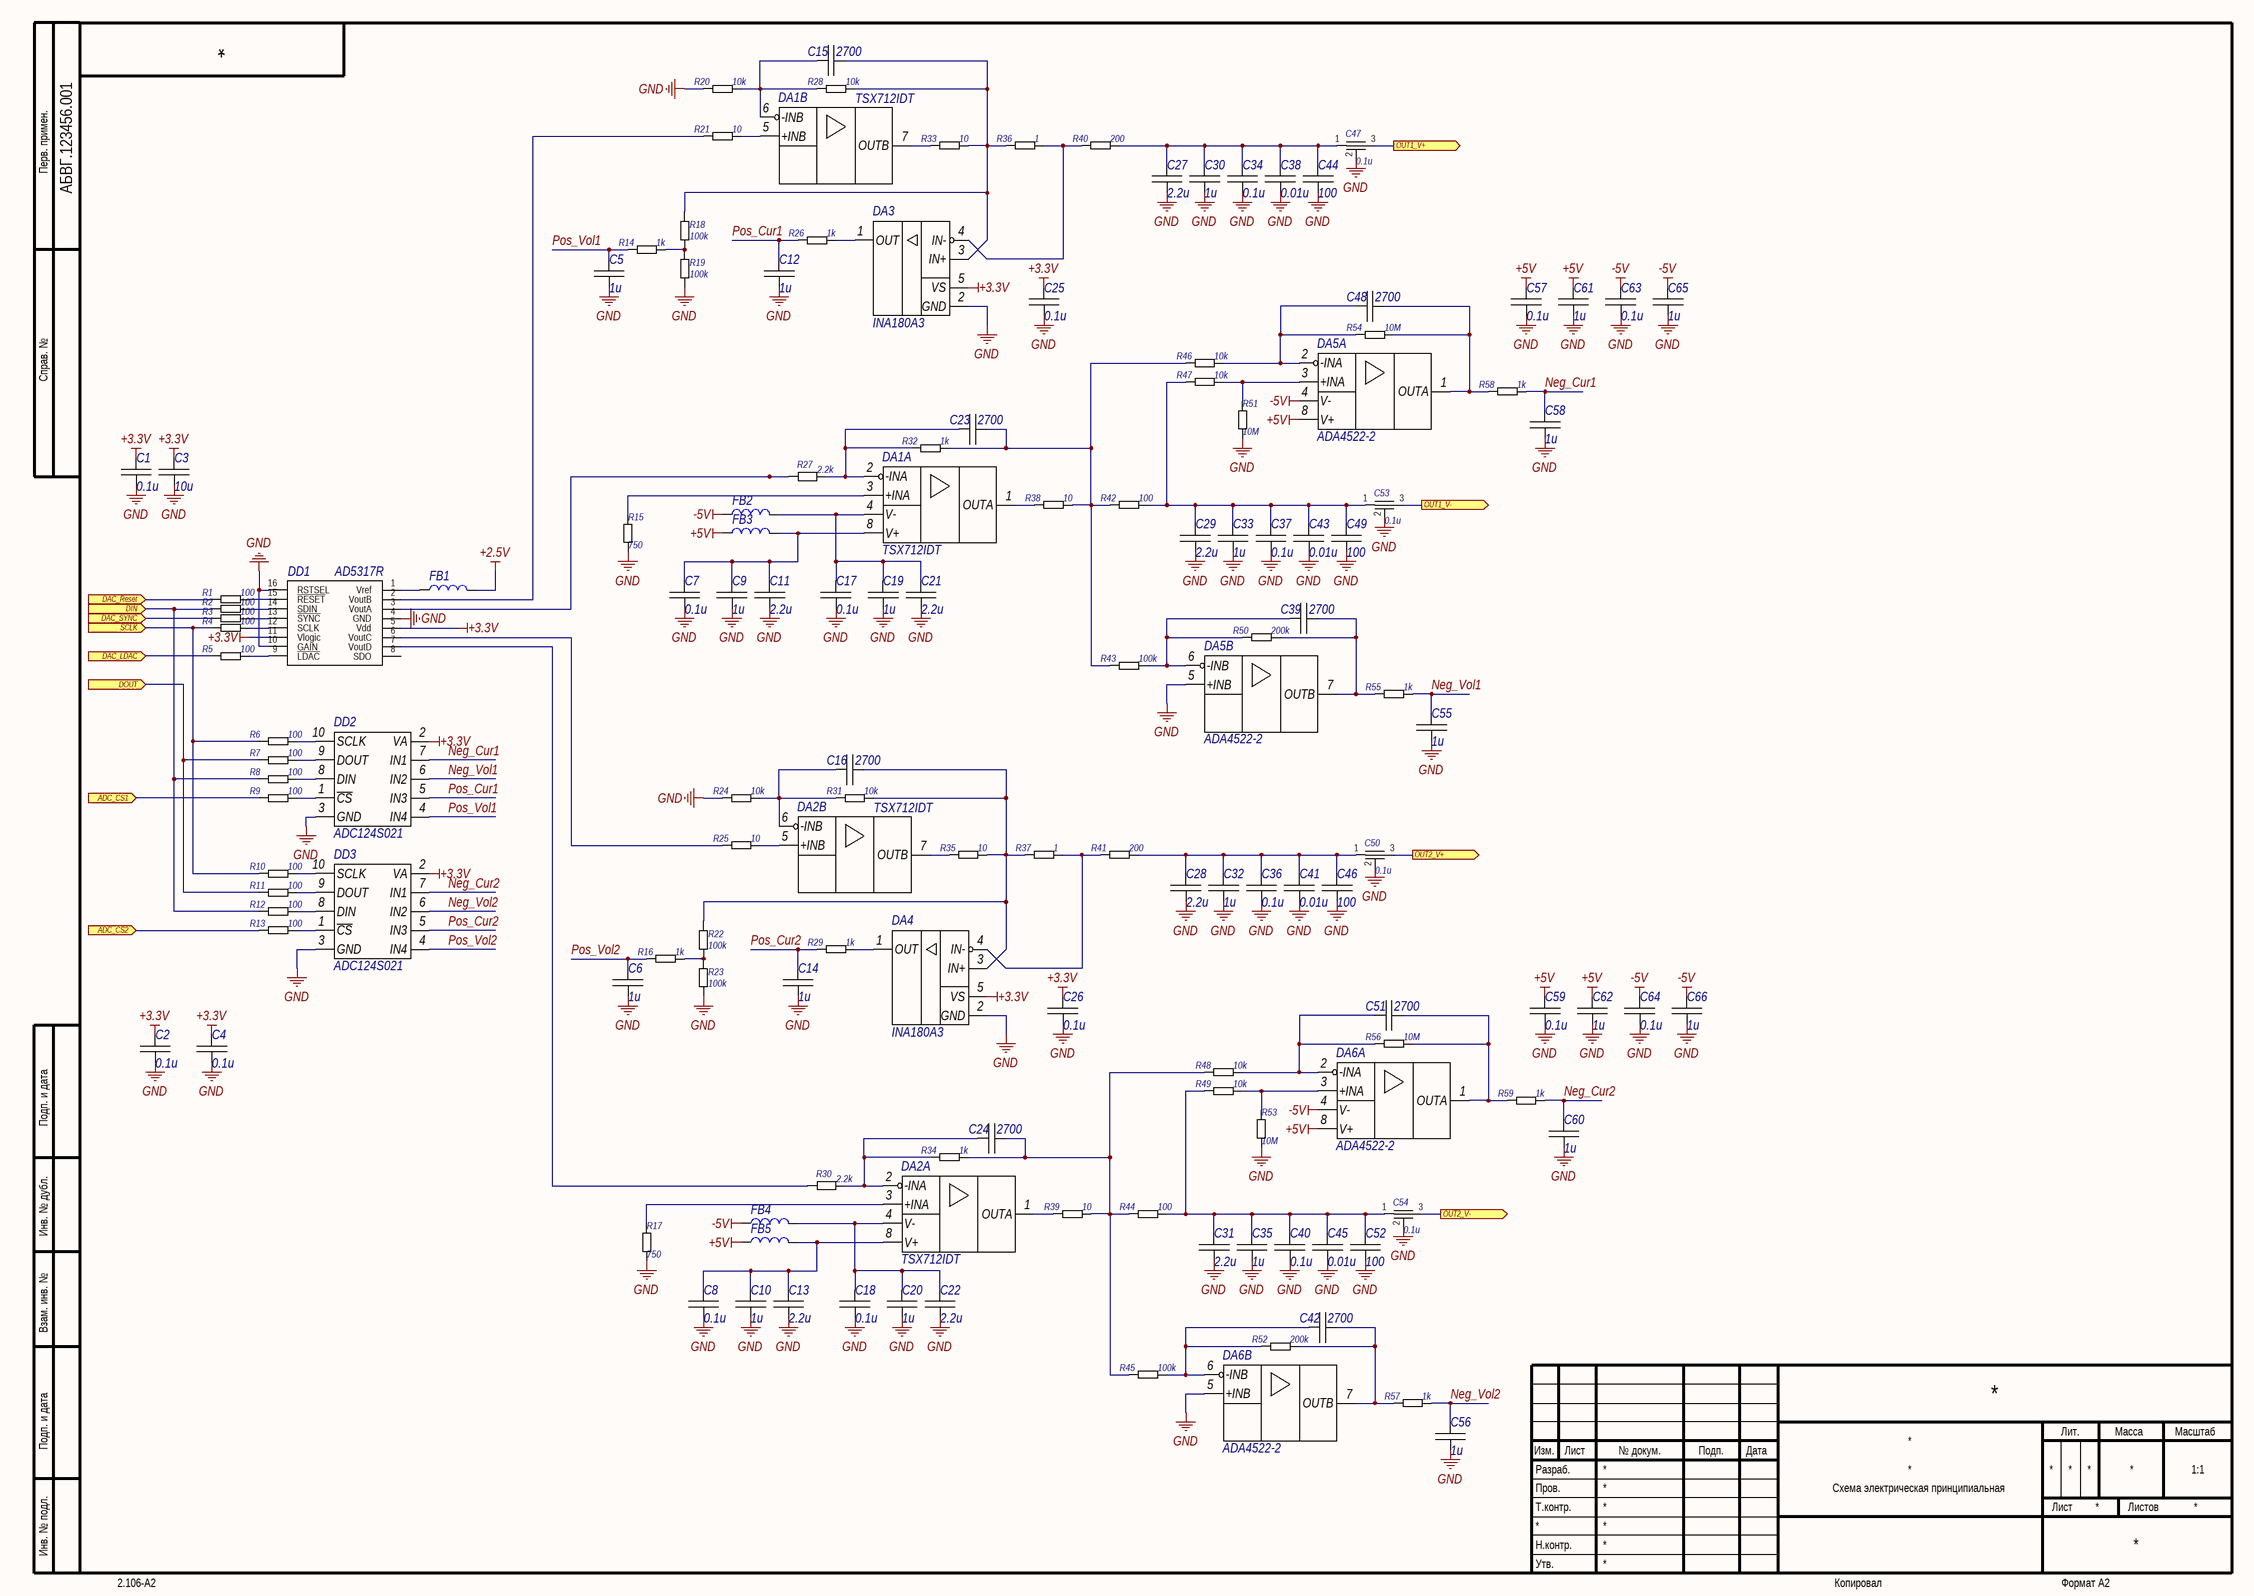
[diagram p3: AnalogPart.SchDoc]

### Parts
C1  0.1u  [C0603]
C2  0.1u  [C0603]
C3  10u  [C0805]
C4  0.1u  [C0603]
C5  1u  [C0805]
C6  1u  [C0805]
C7  0.1u  [C0603]
C8  0.1u  [C0603]
C9  1u  [C0805]
C10  1u  [C0805]
C11  2.2u  [C0805]
C12  1u  [C0805]
C13  2.2u  [C0805]
C14  1u  [C0805]
C15  2700  [C0805]
C16  2700  [C0805]
C17  0.1u  [C0603]
C18  0.1u  [C0603]
C19  1u  [C0805]
C20  1u  [C0805]
C21  2.2u  [C0805]
C22  2.2u  [C0805]
C23  2700  [C0805]
C24  2700  [C0805]
C25  0.1u  [C0603]
C26  0.1u  [C0603]
C27  2.2u  [C0805]
C28  2.2u  [C0805]
C29  2.2u  [C0805]
C30  1u  [C0805]
C31  2.2u  [C0805]
C32  1u  [C0805]
C33  1u  [C0805]
C34  0.1u  [C0805]
C35  1u  [C0805]
C36  0.1u  [C0805]
C37  0.1u  [C0805]
C38  0.01u  [C0805]
C39  2700  [C0805]
C40  0.1u  [C0805]
C41  0.01u  [C0805]
C42  2700  [C0805]
C43  0.01u  [C0805]
C44  100  [C0805]
C45  0.01u  [C0805]
C46  100  [C0805]
C47  0.1u  [T0805]
C48  2700  [C0805]
C49  100  [C0805]
C50  0.1u  [T0805]
C51  2700  [C0805]
C52  100  [C0805]
C53  0.1u  [T0805]
C54  0.1u  [T0805]
C55  1u  [C0805]
C56  1u  [C0805]
C57  0.1u  [C0603]
C58  1u  [C0805]
C59  0.1u  [C0603]
C60  1u  [C0805]
C61  1u  [C0805]
C62  1u  [C0805]
C63  0.1u  [C0603]
C64  0.1u  [C0603]
C65  1u  [C0805]
C66  1u  [C0805]
DA1  TSX712IDT  [SOIC-8]  (parts A,B of 2)
DA2  TSX712IDT  [SOIC-8]  (parts A,B of 2)
DA3  INA180A3  [SOT23-5]
DA4  INA180A3  [SOT23-5]
DA5  ADA4522-2  [TSSOP-8]  (parts A,B of 2)
DA6  ADA4522-2  [TSSOP-8]  (parts A,B of 2)
DD1  AD5317R  [TSSOP-16]
DD2  ADC124S021  [VSSOP-10]
DD3  ADC124S021  [VSSOP-10]
FB1  MH1608-601Y  [L0603]  (value not drawn)
FB2  MH1608-601Y  [L0603]  (value not drawn)
FB3  MH1608-601Y  [L0603]  (value not drawn)
FB4  MH1608-601Y  [L0603]  (value not drawn)
FB5  MH1608-601Y  [L0603]  (value not drawn)
R1  100  [CR0603]
R2  100  [CR0603]
R3  100  [CR0603]
R4  100  [CR0603]
R5  100  [CR0603]
R6  100  [CR0603]
R7  100  [CR0603]
R8  100  [CR0603]
R9  100  [CR0603]
R10  100  [CR0603]
R11  100  [CR0603]
R12  100  [CR0603]
R13  100  [CR0603]
R14  1k  [CR0805]
R15  750  [CR0805]
R16  1k  [CR0805]
R17  750  [CR0805]
R18  100k  [CR0805]
R19  100k  [CR0805]
R20  10k  [CR0805]
R21  10  [CR0805]
R22  100k  [CR0805]
R23  100k  [CR0805]
R24  10k  [CR0805]
R25  10  [CR0805]
R26  1k  [CR0805]
R27  2.2k  [CR0805]
R28  10k  [CR0805]
R29  1k  [CR0805]
R30  2.2k  [CR0805]
R31  10k  [CR0805]
R32  1k  [CR0805]
R33  10  [CR0805]
R34  1k  [CR0805]
R35  10  [CR0805]
R36  1  [CR0805]
R37  1  [CR0805]
R38  10  [CR0805]
R39  10  [CR0805]
R40  200  [CR0805]
R41  200  [CR0805]
R42  100  [CR0805]
R43  100k  [CR0805]
R44  100  [CR0805]
R45  100k  [CR0805]
R46  10k  [CR0805]
R47  10k  [CR0805]
R48  10k  [CR0805]
R49  10k  [CR0805]
R50  200k  [CR0805]
R51  10M  [CR0805]
R52  200k  [CR0805]
R53  10M  [CR0805]
R54  10M  [CR0805]
R55  1k  [CR0805]
R56  10M  [CR0805]
R57  1k  [CR0805]
R58  1k  [CR0805]
R59  1k  [CR0805]

### Ports
ADC_CS1 (in), ADC_CS2 (in), DAC_LDAC (in), DAC_Reset (in), DAC_SYNC (in), DIN (in), DOUT (in), OUT1_V+ (out), OUT1_V- (out), OUT2_V+ (out), OUT2_V- (out), SCLK (in)

### Nets
+2.5V: FB1.2
+3.3V: C1.1 C2.1 C3.1 C4.1 C25.1 C26.1 DA3.5(VS) DA4.5(VS) DD1.5(Vdd) DD1.11(Vlogic) DD2.2(VA) DD3.2(VA)
+5V: C57.1 C59.1 C61.1 C62.1 DA5.8(V+) DA6.8(V+) FB3.1 FB5.1
-5V: C63.1 C64.1 C65.1 C66.1 DA5.4(V-) DA6.4(V-) FB2.1 FB4.1
GND: C1.2 C2.2 C3.2 C4.2 C5.2 C6.2 C7.2 C8.2 C9.2 C10.2 C11.2 C12.2 C13.2 C14.2 C17.2 C18.2 C19.2 C20.2 C21.2 C22.2 C25.2 C26.2 C27.2 C28.2 C29.2 C30.2 C31.2 C32.2 C33.2 C34.2 C35.2 C36.2 C37.2 C38.2 C40.2 C41.2 C43.2 C44.2 C45.2 C46.2 C47.2 C49.2 C50.2 C52.2 C53.2 C54.2 C55.2 C56.2 C57.2 C58.2 C59.2 C60.2 C61.2 C62.2 C63.2 C64.2 C65.2 C66.2 DA3.2(GND) DA4.2(GND) DA5.5(+INB) DA6.5(+INB) DD1.4(GND) DD1.10(GAIN) DD1.16(RSTSEL) DD2.3(GND) DD3.3(GND) R15.1 R17.1 R19.2 R20.2 R23.2 R24.2 R51.1 R53.1
ADC_CS1: R9.1 ; port ADC_CS1
ADC_CS2: R13.1 ; port ADC_CS2
DAC_LDAC: R5.1 ; port DAC_LDAC
DAC_Reset: R1.1 ; port DAC_Reset
DAC_SYNC: R3.1 ; port DAC_SYNC
DIN: R2.1 R8.1 R12.1 ; port DIN
DOUT: R7.1 R11.1 ; port DOUT
Neg_Cur1: C58.1 DD2.7(IN1) R58.2
Neg_Cur2: C60.1 DD3.7(IN1) R59.2
Neg_Vol1: C55.1 DD2.6(IN2) R55.2
Neg_Vol2: C56.1 DD3.6(IN2) R57.2
OUT1_V+: C47.3 ; port OUT1_V+
OUT1_V-: C53.3 ; port OUT1_V-
OUT2_V+: C50.3 ; port OUT2_V+
OUT2_V-: C54.3 ; port OUT2_V-
Pos_Cur1: C12.1 DD2.5(IN3) R26.1
Pos_Cur2: C14.1 DD3.5(IN3) R29.1
Pos_Vol1: C5.1 DD2.4(IN4) R14.1
Pos_Vol2: C6.1 DD3.4(IN4) R16.1
SCLK: R4.1 R6.1 R10.1 ; port SCLK
NetC7_1: C7.1 C9.1 C11.1 DA1.8(V+) FB3.2
NetC8_1: C8.1 C10.1 C13.1 DA2.8(V+) FB5.2
NetC15_1: C15.1 DA1.6(-INB) R20.1 R28.1
NetC15_2: C15.2 DA3.3(IN+) R18.2 R28.2 R33.2 R36.1
NetC16_1: C16.1 DA2.6(-INB) R24.1 R31.1
NetC16_2: C16.2 DA4.3(IN+) R22.2 R31.2 R35.2 R37.1
NetC17_1: C17.1 C19.1 C21.1 DA1.4(V-) FB2.2
NetC18_1: C18.1 C20.1 C22.1 DA2.4(V-) FB4.2
NetC23_1: C23.1 DA1.2(-INA) R27.1 R32.2
NetC23_2: C23.2 R32.1 R38.2 R42.1 R43.1 R46.1
NetC24_1: C24.1 DA2.2(-INA) R30.1 R34.2
NetC24_2: C24.2 R34.1 R39.2 R44.1 R45.1 R48.1
NetC27_1: C27.1 C30.1 C34.1 C38.1 C44.1 C47.1 R40.2
NetC28_1: C28.1 C32.1 C36.1 C41.1 C46.1 C50.1 R41.2
NetC29_1: C29.1 C33.1 C37.1 C43.1 C49.1 C53.1 R42.2 R47.1
NetC31_1: C31.1 C35.1 C40.1 C45.1 C52.1 C54.1 R44.2 R49.1
NetC39_1: C39.1 DA5.6(-INB) R43.2 R50.1
NetC39_2: C39.2 DA5.7(OUTB) R50.2 R55.1
NetC42_1: C42.1 DA6.6(-INB) R45.2 R52.1
NetC42_2: C42.2 DA6.7(OUTB) R52.2 R57.1
NetC48_1: C48.1 DA5.2(-INA) R46.2 R54.1
NetC48_2: C48.2 DA5.1(OUTA) R54.2 R58.1
NetC51_1: C51.1 DA6.2(-INA) R48.2 R56.1
NetC51_2: C51.2 DA6.1(OUTA) R56.2 R59.1
NetDA1_1: DA1.1(OUTA) R38.1
NetDA1_3: DA1.3(+INA) R15.2
NetDA1_5: DA1.5(+INB) R21.1
NetDA1_7: DA1.7(OUTB) R33.1
NetDA2_1: DA2.1(OUTA) R39.1
NetDA2_3: DA2.3(+INA) R17.2
NetDA2_5: DA2.5(+INB) R25.1
NetDA2_7: DA2.7(OUTB) R35.1
NetDA3_1: DA3.1(OUT) R26.2
NetDA3_4: DA3.4(IN-) R36.2 R40.1
NetDA4_1: DA4.1(OUT) R29.2
NetDA4_4: DA4.4(IN-) R37.2 R41.1
NetDA5_3: DA5.3(+INA) R47.2 R51.2
NetDA6_3: DA6.3(+INA) R49.2 R53.2
NetDD1_1: DD1.1(Vref) FB1.1
NetDD1_2: DD1.2(VoutB) R21.2
NetDD1_3: DD1.3(VoutA) R27.2
NetDD1_6: DD1.6(VoutC) R25.2
NetDD1_7: DD1.7(VoutD) R30.2
NetDD1_9: DD1.9(~{LDAC}) R5.2
NetDD1_12: DD1.12(SCLK) R4.2
NetDD1_13: DD1.13(~{SYNC}) R3.2
NetDD1_14: DD1.14(SDIN) R2.2
NetDD1_15: DD1.15(~{RESET}) R1.2
NetDD2_1: DD2.1(~{CS}) R9.2
NetDD2_8: DD2.8(DIN) R8.2
NetDD2_9: DD2.9(DOUT) R7.2
NetDD2_10: DD2.10(SCLK) R6.2
NetDD3_1: DD3.1(~{CS}) R13.2
NetDD3_8: DD3.8(DIN) R12.2
NetDD3_9: DD3.9(DOUT) R11.2
NetDD3_10: DD3.10(SCLK) R10.2
NetR14_2: R14.2 R18.1 R19.1
NetR16_2: R16.2 R22.1 R23.1

Not connected (* = marked no-connect by the designer): DD1 8(SDO)

### Channels
R1: designators end in _R1; ports ADC_CS1=NetDD4_41 ADC_CS2=NetDD4_48 DAC_LDAC=NetDD4_45 DAC_Reset=E1 DAC_SYNC=NetDD4_46 DIN=NetDD4_43 DOUT=NetDD4_44 OUT1_V+=NetC47_R1_3 OUT1_V-=NetC53_R1_3 OUT2_V+=NetC50_R1_3 OUT2_V-=NetC54_R1_3 SCLK=NetDD4_42
R2: designators end in _R2; ports ADC_CS1=NetDD4_51 ADC_CS2=NetDD4_58 DAC_LDAC=NetDD4_55 DAC_Reset=E2 DAC_SYNC=NetDD4_56 DIN=NetDD4_53 DOUT=NetDD4_54 OUT1_V+=NetC47_R2_3 OUT1_V-=NetC53_R2_3 OUT2_V+=NetC50_R2_3 OUT2_V-=NetC54_R2_3 SCLK=NetDD4_52
R3: designators end in _R3; ports ADC_CS1=NetDD4_59 ADC_CS2=NetDD4_66 DAC_LDAC=NetDD4_63 DAC_Reset=E3 DAC_SYNC=NetDD4_64 DIN=NetDD4_61 DOUT=NetDD4_62 OUT1_V+=NetC47_R3_3 OUT1_V-=NetC53_R3_3 OUT2_V+=NetC50_R3_3 OUT2_V-=NetC54_R3_3 SCLK=NetDD4_60

### Notes on the sheet
- Перв. примен.
- Справ. №
- Подп. и дата
- Инв. № дубл.
- Взам. инв. №
- Разраб.
- Изм.
- Лист
- № докум.
- Подп.
- Дата
- Лит.
- Масса
- Масштаб
- Пров.
- Т.контр.
- Листов
- Инв. № подл.
- Утв.
- Н.контр.
- 2.106-A2
- Копировал
- Формат А2

### Library data of the parts
C1-C46 C48 C49 C51 C52 C55-C66 = Capacitor Ceramic SMD
C47 C50 C53 C54 = Cap 3 terminal
DA1 DA2 = ADA4522-2
DA3 DA4 = INA180Ax
FB1-FB5 = Ferrite Bead
R1-R59 = Resistor SMD

## Sheet AC-DC.SchDoc
size 420 x 297 mm; Address1: Address1; Address2: Address2; Address3: Address3; Address4: Address4; DocumentNumber: АБВГ.123456.001 Э3; SheetNumber: 2; Scale: 1:1; DocumentType: Схема электрическая принципиальная; FirstReferrence: АБВГ.123456.001
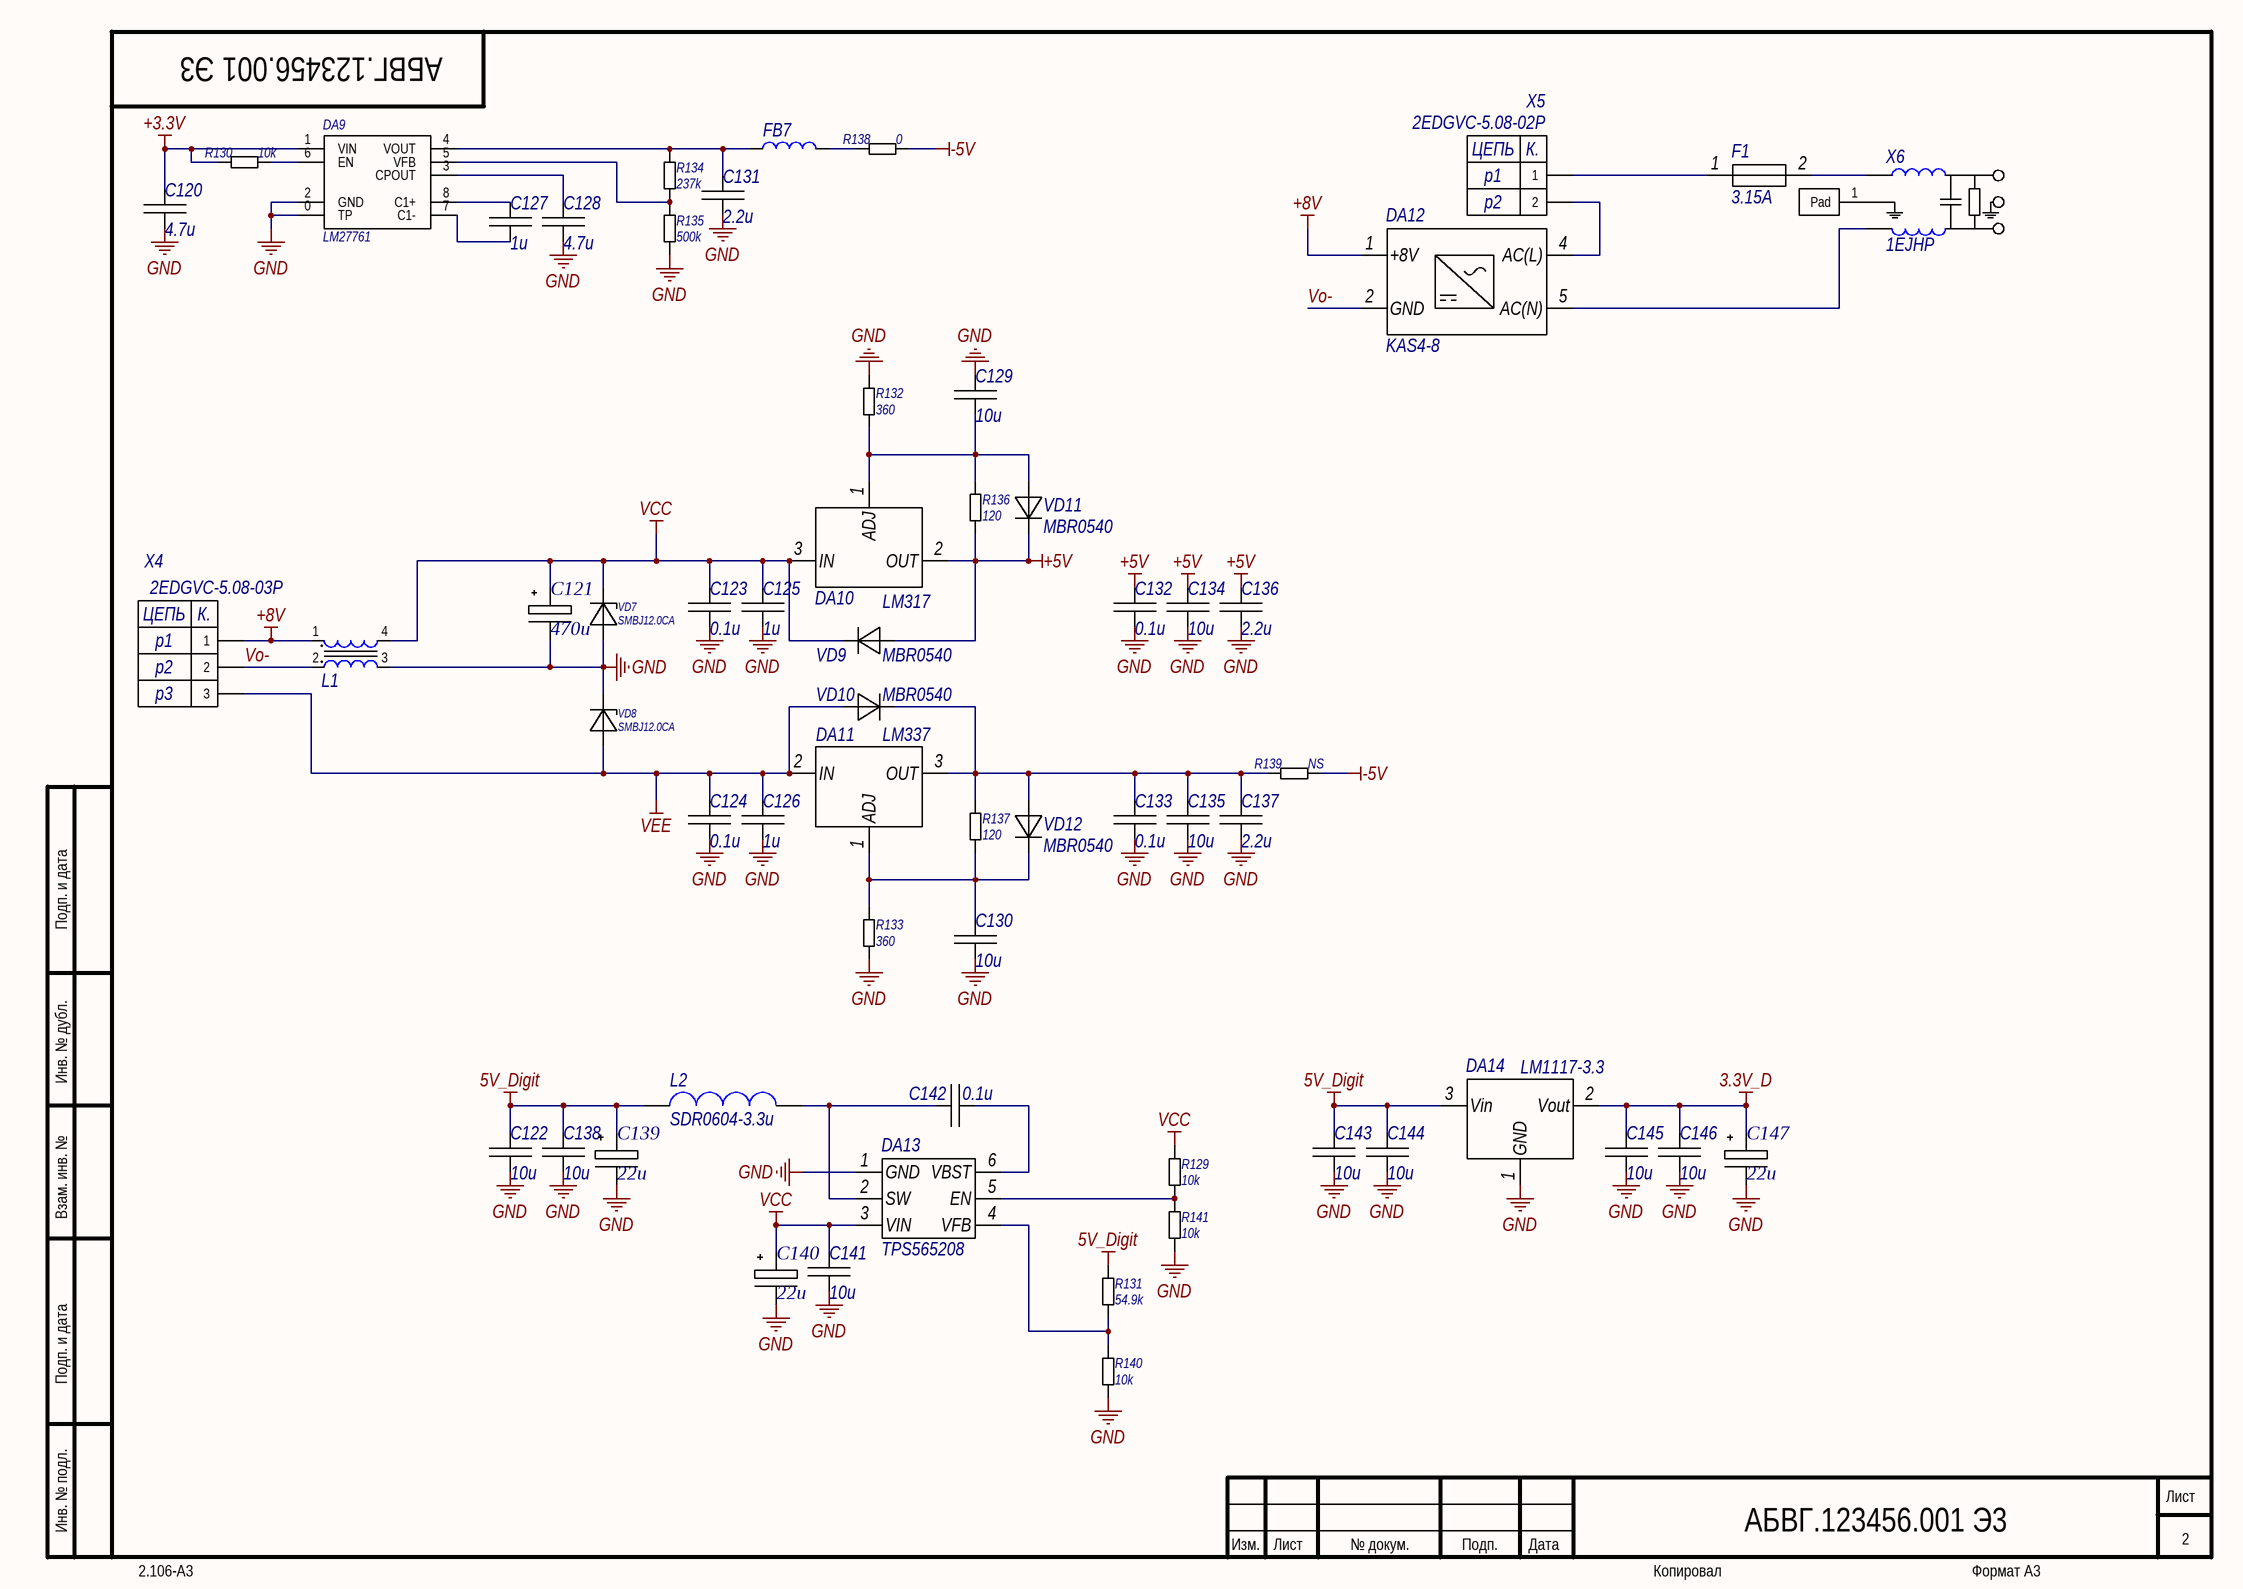
[diagram p4: AC-DC.SchDoc]

### Parts
C120  4.7u  [C0805]
C121  470u  [C1717]
C122  10u  [C1206]
C123  0.1u  [C1206]
C124  0.1u  [C1206]
C125  1u  [C1206]
C126  1u  [C1206]
C127  1u  [C0805]
C128  4.7u  [C0805]
C129  10u  [C1206]
C130  10u  [C1206]
C131  2.2u  [C0805]
C132  0.1u  [C1206]
C133  0.1u  [C1206]
C134  10u  [C1206]
C135  10u  [C1206]
C136  2.2u  [C1206]
C137  2.2u  [C1206]
C138  10u  [C1206]
C139  22u  [C0605]
C140  22u  [C0605]
C141  10u  [C1206]
C142  0.1u  [C1206]
C143  10u  [C1206]
C144  10u  [C1206]
C145  10u  [C1206]
C146  10u  [C1206]
C147  22u  [C0605]
DA9  LM27761  [WSON-8]
DA10  LM317  [D2PAK]
DA11  LM337  [D2PAK]
DA12  KAS4-8  [KAS4-8]
DA13  TPS565208  [SOT23-6]
DA14  LM1117-3.3  [DPAK - LM1117]
F1  3.15A  [5x20mm]
FB7  MH1608-601Y  [L0603]  (value not drawn)
L1  744221  [WE-SL2 SMD]  (value not drawn)
L2  SDR0604-3.3u  [SDR0604]
P1  PAD  [PAD]  (value not drawn)
R129  10k  [CR0805]
R130  10k  [CR0805]
R131  54.9k  [CR0805]
R132  360  [CR1206]
R133  360  [CR1206]
R134  237k  [CR0805]
R135  500k  [CR0805]
R136  120  [CR1206]
R137  120  [CR1206]
R138  0  [CR0805]
R139  NS  [CR0805]
R140  10k  [CR0805]
R141  10k  [CR0805]
VD7  SMBJ12.0CA  [DO-214AA]
VD8  SMBJ12.0CA  [DO-214AA]
VD9  MBR0540  [SOD123]
VD10  MBR0540  [SOD123]
VD11  MBR0540  [SOD123]
VD12  MBR0540  [SOD123]
X4  2EDGVC-5.08-03P  [2EDGVC-5.08-03P]
X5  2EDGVC-5.08-02P  [2EDGVC-5.08-02P]
X6  1EJHP  [1EJHP]

### Nets
3.3V_D: C145.1 C146.1 C147.1 DA14.2(Vout)
5V_Digit: C122.1 C138.1 C139.1 C143.1 C144.1 DA14.3(Vin) L2.1 R131.1
+3.3V: C120.1 DA9.1(VIN) R130.2
+5V: C132.1 C134.1 C136.1 DA10.2(OUT) R136.1 VD9.2 VD11.1
+8V: DA12.1(+8V) L1.1 X4.1
-5V: R138.1 R139.1
GND: C120.2 C121.2 C122.2 C123.2 C124.2 C125.2 C126.2 C128.2 C129.1 C130.2 C131.2 C132.2 C133.2 C134.2 C135.2 C136.2 C137.2 C138.2 C139.2 C140.2 C141.2 C143.2 C144.2 C145.2 C146.2 C147.2 DA9.0(TP) DA9.2(GND) DA13.1(GND) DA14.1(GND) L1.3 R132.2 R133.1 R135.1 R140.2 R141.2 VD7.2 VD8.1
VCC: C121.1 C123.1 C125.1 C140.1 C141.1 DA10.3(IN) DA13.3(VIN) L1.4 R129.1 VD7.1 VD9.1
VEE: C124.1 C126.1 DA11.2(IN) VD8.2 VD10.2 X4.3
Vo-: DA12.2(GND) L1.2 X4.2
NetC127_1: C127.1 DA9.8(C1+)
NetC127_2: C127.2 DA9.7(C1-)
NetC128_1: C128.1 DA9.3(CPOUT)
NetC129_2: C129.2 DA10.1(ADJ) R132.1 R136.2 VD11.2
NetC130_1: C130.1 DA11.1(ADJ) R133.2 R137.1 VD12.1
NetC131_1: C131.1 DA9.4(VOUT) FB7.1 R134.2
NetC133_1: C133.1 C135.1 C137.1 DA11.3(OUT) R137.2 R139.2 VD10.1 VD12.2
NetC142_1: C142.1 DA13.2(SW) L2.2
NetC142_2: C142.2 DA13.6(VBST)
NetDA9_5: DA9.5(VFB) R134.1 R135.2
NetDA9_6: DA9.6(EN) R130.1
NetDA12_4: DA12.4(AC(L)) X5.2
NetDA12_5: DA12.5(AC(N)) X6.2(AC(N))
NetDA13_4: DA13.4(VFB) R131.2 R140.1
NetDA13_5: DA13.5(EN) R129.2 R141.1
NetF1_1: F1.1(IN) X5.1
NetF1_2: F1.2(OUT) X6.1(AC(L))
NetFB7_2: FB7.2 R138.2
NetP1_1: P1.1(Pad) X6.3(G)

Not connected (* = marked no-connect by the designer): DA12 3(NC) 6(NC)

### Notes on the sheet
- Подп. и дата
- Инв. № дубл.
- Взам. инв. №
- Инв. № подл.
- Изм.
- Лист
- № докум.
- Подп.
- Дата
- 2.106-A3
- Копировал
- Формат А3
- (in symbol 2EDGVC-5.08-02P) ЦЕПЬ; К.; p1; p2
- (in symbol 2EDGVC-5.08-03P) ЦЕПЬ; К.; p1; p2; p3

### Library data of the parts
C120 C122-C138 C141-C146 = Capacitor Ceramic SMD
C121 C139 C140 C147 = Capacitor Electrolytic
DA14 = LM1117
F1 = FUSE_HOLDER
FB7 = Ferrite Bead
L1 = CommonModeChoke
L2 = SDR0604
R129-R141 = Resistor SMD
VD7 VD8 = SMBJ5.0CA
VD9-VD12 = Diode

## Nets that join several sheets
3.3V_D: MCU (53 pins), AC-DC (C145.1 C146.1 C147.1 DA14.2)
5V_Digit: MCU (X1.17 X1.18 X2.9 X2.10), AC-DC (8 pins)
+2.5V: MCU (C73.1 C75.1 DA8.6), R1 (FB1_R1.2), R2 (FB1_R2.2), R3 (FB1_R3.2)
+3.3V: MCU (10 pins), R1 (12 pins), R2 (12 pins), R3 (12 pins), AC-DC (C120.1 DA9.1 R130.2)
+5V: MCU (5 pins), R1 (8 pins), R2 (8 pins), R3 (8 pins), AC-DC (7 pins)
-5V: R1 (8 pins), R2 (8 pins), R3 (8 pins), AC-DC (R138.1 R139.1)
GND: OutputConnection (12 pins), MCU (91 pins), R1 (75 pins), R2 (75 pins), R3 (75 pins), AC-DC (38 pins)
E1: MCU (DD4.47 R71.1), R1 (R1_R1.1)
E2: MCU (DD4.57 R72.1), R2 (R1_R2.1)
E3: MCU (DD4.65 R73.1), R3 (R1_R3.1)
NetC47_R1_3: OutputConnection (X3.12), R1 (C47_R1.3)
NetC47_R2_3: OutputConnection (X3.8), R2 (C47_R2.3)
NetC47_R3_3: OutputConnection (X3.4), R3 (C47_R3.3)
NetC50_R1_3: OutputConnection (X3.10), R1 (C50_R1.3)
NetC50_R2_3: OutputConnection (X3.6), R2 (C50_R2.3)
NetC50_R3_3: OutputConnection (X3.2), R3 (C50_R3.3)
NetC53_R1_3: OutputConnection (X3.11), R1 (C53_R1.3)
NetC53_R2_3: OutputConnection (X3.7), R2 (C53_R2.3)
NetC53_R3_3: OutputConnection (X3.3), R3 (C53_R3.3)
NetC54_R1_3: OutputConnection (X3.9), R1 (C54_R1.3)
NetC54_R2_3: OutputConnection (X3.5), R2 (C54_R2.3)
NetC54_R3_3: OutputConnection (X3.1), R3 (C54_R3.3)
NetDD4_41: MCU (DD4.41), R1 (R9_R1.1)
NetDD4_42: MCU (DD4.42), R1 (R4_R1.1 R6_R1.1 R10_R1.1)
NetDD4_43: MCU (DD4.43), R1 (R2_R1.1 R8_R1.1 R12_R1.1)
NetDD4_44: MCU (DD4.44), R1 (R7_R1.1 R11_R1.1)
NetDD4_45: MCU (DD4.45), R1 (R5_R1.1)
NetDD4_46: MCU (DD4.46), R1 (R3_R1.1)
NetDD4_48: MCU (DD4.48), R1 (R13_R1.1)
NetDD4_51: MCU (DD4.51), R2 (R9_R2.1)
NetDD4_52: MCU (DD4.52), R2 (R4_R2.1 R6_R2.1 R10_R2.1)
NetDD4_53: MCU (DD4.53), R2 (R2_R2.1 R8_R2.1 R12_R2.1)
NetDD4_54: MCU (DD4.54), R2 (R7_R2.1 R11_R2.1)
NetDD4_55: MCU (DD4.55), R2 (R5_R2.1)
NetDD4_56: MCU (DD4.56), R2 (R3_R2.1)
NetDD4_58: MCU (DD4.58), R2 (R13_R2.1)
NetDD4_59: MCU (DD4.59), R3 (R9_R3.1)
NetDD4_60: MCU (DD4.60), R3 (R4_R3.1 R6_R3.1 R10_R3.1)
NetDD4_61: MCU (DD4.61), R3 (R2_R3.1 R8_R3.1 R12_R3.1)
NetDD4_62: MCU (DD4.62), R3 (R7_R3.1 R11_R3.1)
NetDD4_63: MCU (DD4.63), R3 (R5_R3.1)
NetDD4_64: MCU (DD4.64), R3 (R3_R3.1)
NetDD4_66: MCU (DD4.66), R3 (R13_R3.1)